# Altium schematic sheet Recovery.SchDoc
size Letter; Organization: Altium Limited; Address1: L3, 12a Rodborough Rd; Address2: Frenchs Forest; Address3: NSW; Address4: Australia 2086
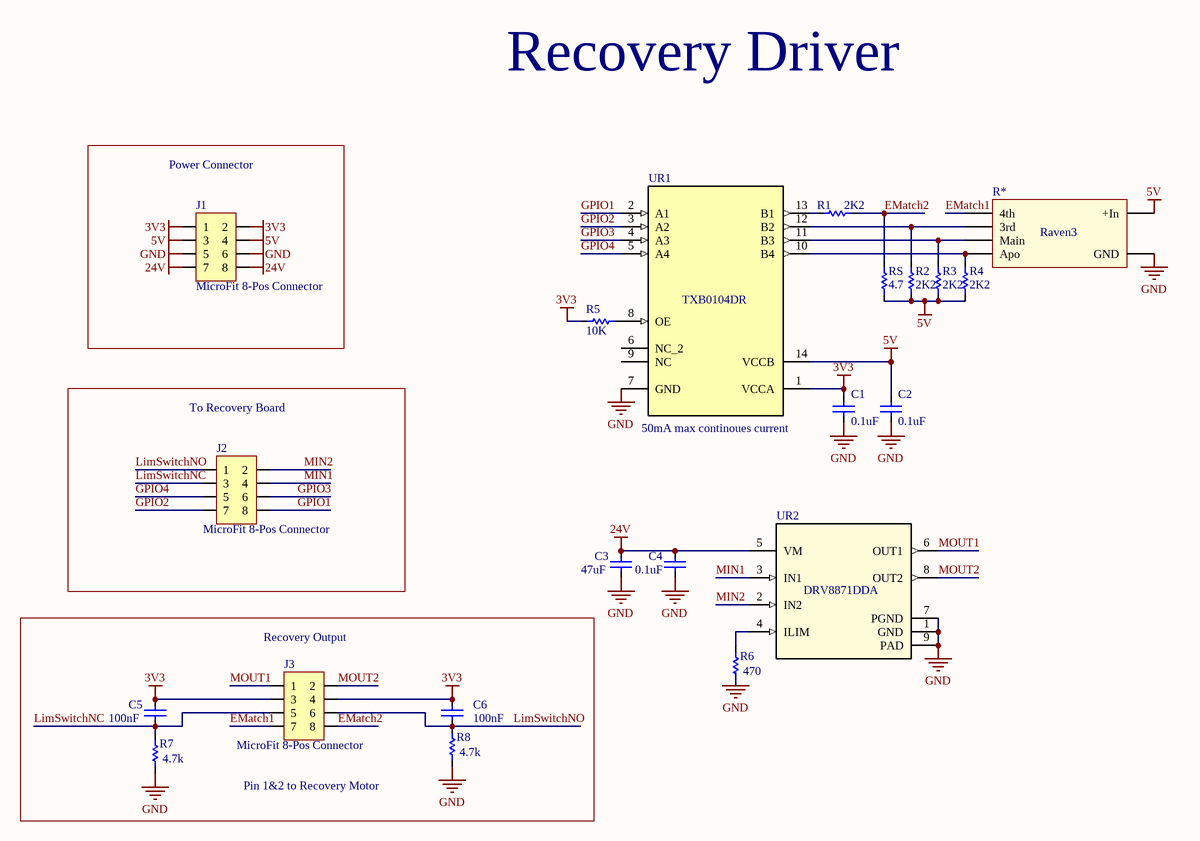
[diagram p0: Recovery.SchDoc]

## Parts
C1  value 0.1uF  [C0805C475K9RACAUTO]  (hidden comment: Cap)
C2  value 0.1uF  [C0805C475K9RACAUTO]  (hidden comment: Cap)
C3  value 47uF  [C0805C475K9RACAUTO]  (hidden comment: Cap)
C4  value 0.1uF  [C0805C475K9RACAUTO]  (hidden comment: Cap)
C5  value 100nF  [C0805C475K9RACAUTO]  (hidden comment: Cap)
C6  value 100nF  [C0805C475K9RACAUTO]  (hidden comment: Cap)
J1  MicroFit 8-Pos Connector  [Microfit-8Pos]
J2  MicroFit 8-Pos Connector  [Microfit-8Pos]
J3  MicroFit 8-Pos Connector  [Microfit-8Pos]
R1  value 2K2  [RES 0805]  (hidden comment: Res)
R2  value 2K2  [RES 0805]  (hidden comment: Res)
R3  value 2K2  [RES 0805]  (hidden comment: Res)
R4  value 2K2  [RES 0805]  (hidden comment: Res)
R5  value 10K  [RES 0805]  (hidden comment: Res)
R6  value 470  [RES 0805]  (hidden comment: Res)
R7  value 4.7k  [RES 0805]  (hidden comment: Res)
R8  value 4.7k  [RES 0805]  (hidden comment: Res)
R*  Raven3  [Raven3]
RS  value 4.7  [RES 0805]  (hidden comment: Res)
UR1  TXB0104DR  [SOIC127P600X175-14N]
UR2  DRV8871DDA  [DDA0008H_N]

## Blocks framed on the sheet
Power Connector: J1
To Recovery Board: J2

## Nets
3V3: C1.2 C5.2 C6.1 J1.1 J1.2 J3.3 J3.4 R5.1 UR1.1(VCCA)
5V: C2.1 J1.3 J1.4 R2.2 R3.2 R4.2 R*.6(+In) RS.2 UR1.14(VCCB)
24V: C3.2 C4.2 J1.7 J1.8 UR2.5(VM)
GND: C1.1 C2.2 C3.1 C4.1 J1.5 J1.6 R6.1 R7.1 R8.1 R*.5(GND) UR1.7(GND) UR2.1(GND) UR2.7(PGND) UR2.9(PAD)
EMatch1: J3.7 R*.1(4th)
EMatch2: J3.8 R1.2 RS.1
GPIO1: J2.8 UR1.2(A1)
GPIO2: J2.7 UR1.3(A2)
GPIO3: J2.6 UR1.4(A3)
GPIO4: J2.5 UR1.5(A4)
LimSwitchNC: C5.1 J2.3 J3.5 R7.2
LimSwitchNO: C6.2 J2.1 J3.6 R8.2
MIN1: J2.4 UR2.3(IN1)
MIN2: J2.2 UR2.2(IN2)
MOUT1: J3.1 UR2.6(OUT1)
MOUT2: J3.2 UR2.8(OUT2)
NetR1_1: R1.1 UR1.13(B1)
NetR2_1: R2.1 R*.2(3rd) UR1.12(B2)
NetR3_1: R3.1 R*.3(Main) UR1.11(B3)
NetR4_1: R4.1 R*.4(Apo) UR1.10(B4)
NetR5_2: R5.2 UR1.8(OE)
NetR6_2: R6.2 UR2.4(ILIM)

Not connected (* = marked no-connect by the designer): UR1 6(NC_2) 9(NC)

## Notes on the sheet
- Recovery Driver
- 50mA max continoues current
- (near J3) Recovery Output
- Pin 1&2 to Recovery Motor
- Title
- Size:
- Date:
- Letter
- Number:
- Time:
- Revision:
- Sheet
- of
- File:

## Library data of the parts
J1-J3 = Micro-Fit 8Pos: Molex MicroFit 8-Pos Connector; URL: https://www.digikey.com/products/en?WT.z_cid=sp_900_0310_buynow&keywords=430450813; DigiKey PN: WM2651-ND
R* = Raven3: Altimeter
UR1 = TXB0104DR: 4-Bit Bidirectional Voltage-Level Shifter with Auto Direction Sensing and +/-15 kV ESD Protect 14-SOIC -40 to 85; MF: Texas Instruments; MP: TXB0104DR; Package: SOIC-14 Texas Instruments; SnapEDA_Link: https://www.snapeda.com/symbols-footprints/TXB0104DR/Texas%20Instruments/view-part/?ref=snap; Price: 0.76 USD; Availability: Good; Value: *
UR2 = DRV8871DDA: Imported; PartNumber: DRV8871DDAR; Manufacturer: Texas Instruments; CompType: IC; PIN_COUNT: 9; Alternate_PartNumber: DRV8871DDA; PackageReference: DDA0008H; MountType: SMT; RefDes: RefDes; TYPE: TYPE; Value: Value